# Altium schematic sheet Sheet2.SchDoc
size A4; Organization: Altium Limited; Address1: L3, 12a Rodborough Rd; Address2: Frenchs Forest; Address3: NSW; Address4: Australia 2086
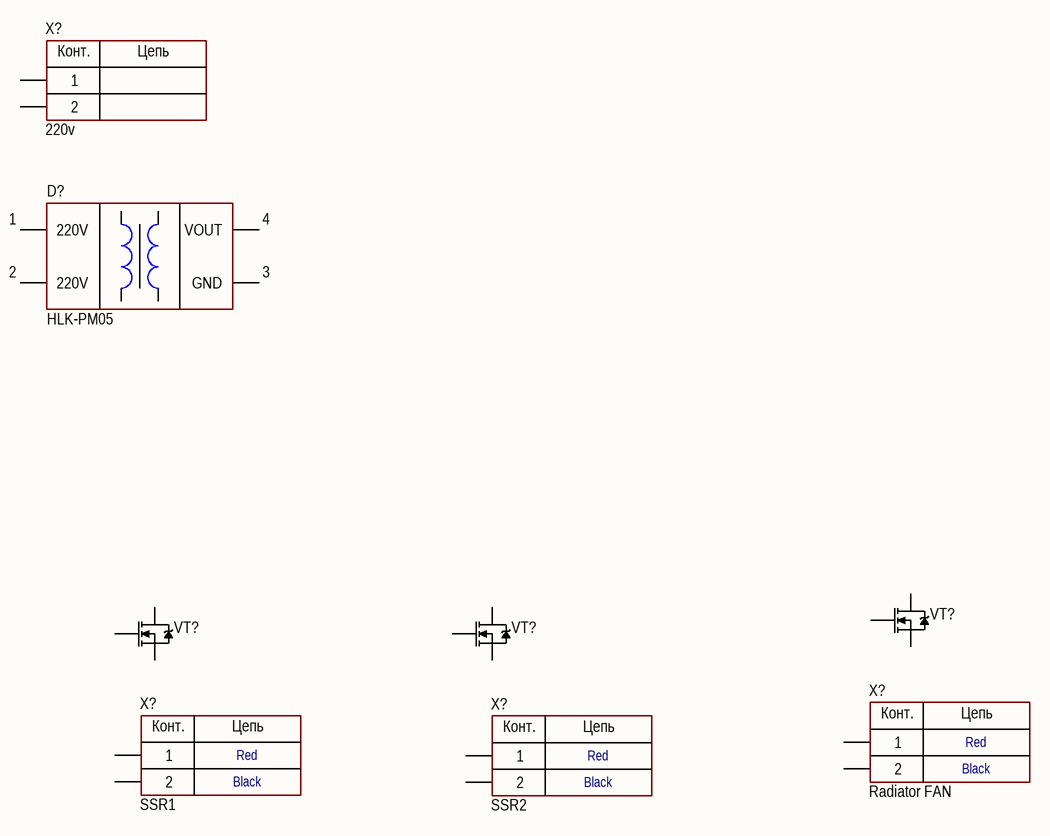
[diagram p0: Sheet2.SchDoc]

## Parts
(Parts that share a designator on the sheet are numbered #1, #2 ... from top to bottom, then left to right.)
D?  (no value)  [MOD: HLK-PM01]
VT?#1  (no value)  [SOT23]
VT?#2  (no value)  [SOT23]
VT?#3  (no value)  [SOT23]
X?#1  CommentText: 220v  [CON: 0395430002 (5 mm)]
X?#2  CommentText: Radiator FAN  [CON: CWF-2]
X?#3  CommentText: SSR1  [CON: CWF-2]
X?#4  CommentText: SSR2  [CON: CWF-2]

## Nets

Not connected (* = marked no-connect by the designer): D? 1(220V) 2(220V) 3(GND) 4(VOUT); VT?#1 1(G) 2(S) 3(D); VT?#2 1(G) 2(S) 3(D); VT?#3 1(G) 2(S) 3(D); X?#1 1 2; X?#2 1 2; X?#3 1 2; X?#4 1 2

## Notes on the sheet
- Title
- Size:
- Date:
- A4
- Number:
- Time:
- Revision:
- Sheet
- of
- File:
- (in symbol Connector_terminal_2pin) Конт.; Цепь
- (in symbol CWF-2) Конт.; Цепь; Red; Black

## Library data of the parts
D? = HLK-PM05: AC/DC converter; Manufacturer: Mornsun; ValueManufacturerPartNumber: AC/DC converter, isolator, 3V 900mA, 100...240VAC, -40...+105°C, 30x20x15mm; OutputType: isolator; OutputVoltage: 3V 900mA; InputVoltage: 100...240VAC; HelpURL: https://ru.aliexpress.com/item/32408565688.html; Package: 30x20x15mm; ComponentType: AC/DC converter; Temperature: -40...+105°C; PartNumber: HLK-PM05
VT?#1-VT?#3 = MOSFET_N_132: Manufacturer: Infineon Technologies; ValueManufacturerPartNumber: MOSFET N-channel transistor, 80V, 7A, 9.1nC, 2.5W, 34mOhm, 756pF, 8-TDSON, -55...+150°C; PartNumber: BSC340N08NS3GATMA1; TypeTransistor: MOSFET N-channel transistor; VoltageDS: 80V; CurrentDS: 7A; RDS: 34mOhm; GateCharge: 9.1nC; InputCapacitor: 756pF; MaxPower: 2.5W; Package: 8-TDSON; HelpURL: https://www.digikey.com/product-detail/en/infineon-technologies/BSC340N08NS3GATMA1/BSC340N08NS3GATMA1TR-ND/2080655; Temperature: -55...+150°C
X?#1 = Connector_terminal_2pin: Manufacturer: Degson; ValueManufacturerPartNumber: Terminal connector, 2pin, 3.5mm, 300VAC, 10A; PartNumber: DG350-3.5-02P-14; TypeConnector: Terminal connector; VoltageMax: 300VAC; Pitch: 3.5mm; CurrentMax: 10A; Multichannel: 2pin; HelpURL: https://www.chipdip.ru/product/dg350-3.5-02p-12
X?#2-X?#4 = CWF-2: Manufacturer: Connfly; ValueManufacturerPartNumber: Connector, 2pin, 2.54mm, 250VAC, 3A; PartNumber: CWF-2R; TypeConnector: Connector; VoltageMax: 250VAC; Pitch: 2.54mm; CurrentMax: 3A; Multichannel: 2pin; HelpURL: https://www.chipdip.ru/product/cwf-2r-ds1069-2-mr